# Altium project AMA4B_Core_board.PrjPcb (part 3 of 3)
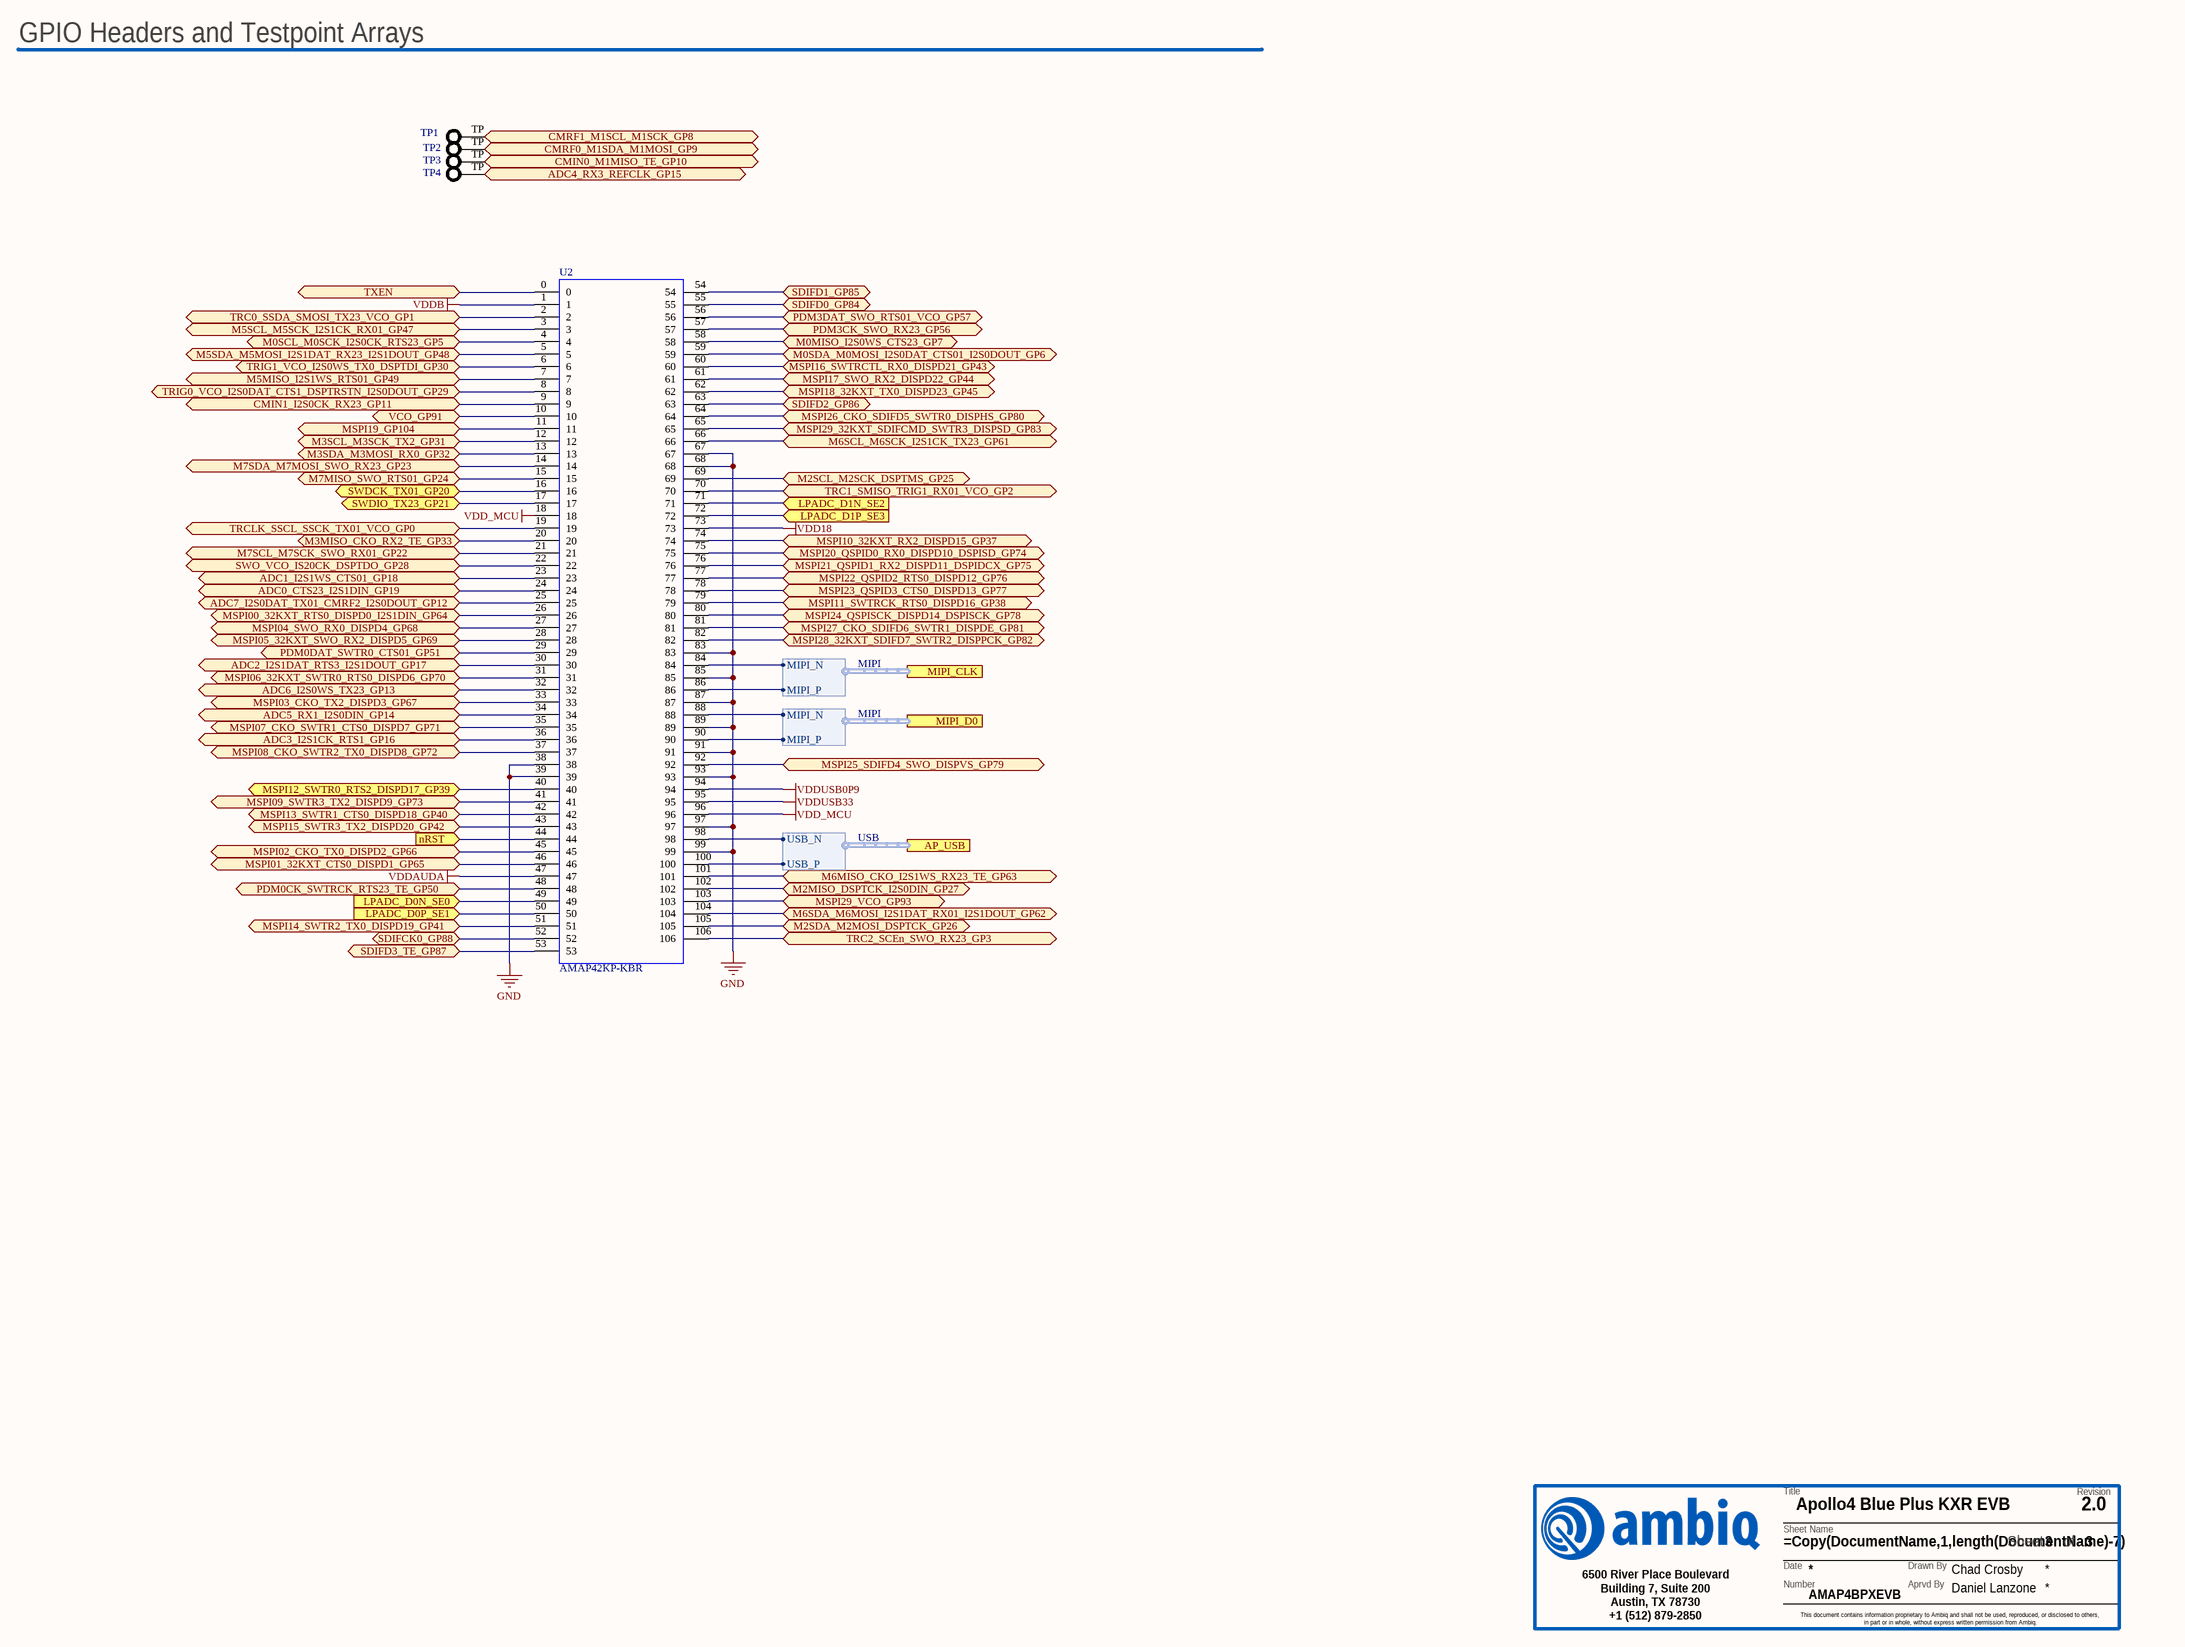
[diagram p5: P03_GPIO.SchDoc]

## Nets that join several sheets
GND: P02_ Apollo 4 Blue Plus (41 pins), P03_GPIO (12 pins)
VDD18: P02_ Apollo 4 Blue Plus (C17.1 U1.H10), P03_GPIO (U2.73)
VDD_MCU: P02_ Apollo 4 Blue Plus (12 pins), P03_GPIO (U2.18 U2.96)
VDDAUDA: P02_ Apollo 4 Blue Plus (C18.1 U1.B11), P03_GPIO (U2.47)
VDDB: P02_ Apollo 4 Blue Plus (C27.1 U1.G1), P03_GPIO (U2.1)
VDDUSB0P9: P02_ Apollo 4 Blue Plus (C21.1 U1.L7), P03_GPIO (U2.94)
VDDUSB33: P02_ Apollo 4 Blue Plus (C22.1 U1.K7), P03_GPIO (U2.95)
ADC0_CTS23_I2S1DIN_GP19: P02_ Apollo 4 Blue Plus (U1.C3), P03_GPIO (U2.24)
ADC1_I2S1WS_CTS01_GP18: P02_ Apollo 4 Blue Plus (U1.D3), P03_GPIO (U2.23)
ADC2_I2S1DAT_RTS3_I2S1DOUT_GP17: P02_ Apollo 4 Blue Plus (U1.D4), P03_GPIO (U2.30)
ADC3_I2S1CK_RTS1_GP16: P02_ Apollo 4 Blue Plus (U1.D7), P03_GPIO (U2.36)
ADC4_RX3_REFCLK_GP15: P02_ Apollo 4 Blue Plus (U1.E5), P03_GPIO (TP4.TP)
ADC5_RX1_I2S0DIN_GP14: P02_ Apollo 4 Blue Plus (U1.D6), P03_GPIO (U2.34)
ADC6_I2S0WS_TX23_GP13: P02_ Apollo 4 Blue Plus (U1.D5), P03_GPIO (U2.32)
ADC7_I2S0DAT_TX01_CMRF2_I2S0DOUT_GP12: P02_ Apollo 4 Blue Plus (U1.B4), P03_GPIO (U2.25)
AP4_USB_N: P02_ Apollo 4 Blue Plus (U1.M8), P03_GPIO (U2.98)
AP4_USB_P: P02_ Apollo 4 Blue Plus (U1.M7), P03_GPIO (U2.100)
CMIN0_M1MISO_TE_GP10: P02_ Apollo 4 Blue Plus (U1.E6), P03_GPIO (TP3.TP)
CMIN1_I2S0CK_RX23_GP11: P02_ Apollo 4 Blue Plus (U1.E4), P03_GPIO (U2.9)
CMRF0_M1SDA_M1MOSI_GP9: P02_ Apollo 4 Blue Plus (U1.E7), P03_GPIO (TP2.TP)
CMRF1_M1SCL_M1SCK_GP8: P02_ Apollo 4 Blue Plus (U1.E8), P03_GPIO (TP1.TP)
LPADC_D0N_SE0: P02_ Apollo 4 Blue Plus (U1.A10), P03_GPIO (U2.49)
LPADC_D0P_SE1: P02_ Apollo 4 Blue Plus (U1.A11), P03_GPIO (U2.50)
LPADC_D1N_SE2: P02_ Apollo 4 Blue Plus (U1.C11), P03_GPIO (U2.71)
LPADC_D1P_SE3: P02_ Apollo 4 Blue Plus (U1.D11), P03_GPIO (U2.72)
M0MISO_I2S0WS_CTS23_GP7: P02_ Apollo 4 Blue Plus (U1.J6), P03_GPIO (U2.58)
M0SCL_M0SCK_I2S0CK_RTS23_GP5: P02_ Apollo 4 Blue Plus (U1.H4), P03_GPIO (U2.4)
M0SDA_M0MOSI_I2S0DAT_CTS01_I2S0DOUT_GP6: P02_ Apollo 4 Blue Plus (U1.J5), P03_GPIO (U2.59)
M2MISO_DSPTCK_I2S0DIN_GP27: P02_ Apollo 4 Blue Plus (U1.M5), P03_GPIO (U2.102)
M2SCL_M2SCK_DSPTMS_GP25: P02_ Apollo 4 Blue Plus (U1.K5), P03_GPIO (U2.69)
M2SDA_M2MOSI_DSPTCK_GP26: P02_ Apollo 4 Blue Plus (U1.L5), P03_GPIO (U2.105)
M3MISO_CKO_RX2_TE_GP33: P02_ Apollo 4 Blue Plus (U1.G3), P03_GPIO (U2.20)
M3SCL_M3SCK_TX2_GP31: P02_ Apollo 4 Blue Plus (U1.H2), P03_GPIO (U2.12)
M3SDA_M3MOSI_RX0_GP32: P02_ Apollo 4 Blue Plus (U1.G2), P03_GPIO (U2.13)
M5MISO_I2S1WS_RTS01_GP49: P02_ Apollo 4 Blue Plus (U1.D1), P03_GPIO (U2.7)
M5SCL_M5SCK_I2S1CK_RX01_GP47: P02_ Apollo 4 Blue Plus (U1.F1), P03_GPIO (U2.3)
M5SDA_M5MOSI_I2S1DAT_RX23_I2S1DOUT_GP48: P02_ Apollo 4 Blue Plus (U1.E1), P03_GPIO (U2.5)
M6MISO_CKO_I2S1WS_RX23_TE_GP63: P02_ Apollo 4 Blue Plus (U1.M6), P03_GPIO (U2.101)
M6SCL_M6SCK_I2S1CK_TX23_GP61: P02_ Apollo 4 Blue Plus (U1.K6), P03_GPIO (U2.66)
M6SDA_M6MOSI_I2S1DAT_RX01_I2S1DOUT_GP62: P02_ Apollo 4 Blue Plus (U1.L6), P03_GPIO (U2.104)
M7MISO_SWO_RTS01_GP24: P02_ Apollo 4 Blue Plus (U1.E2), P03_GPIO (U2.15)
M7SCL_M7SCK_SWO_RX01_GP22: P02_ Apollo 4 Blue Plus (U1.F3), P03_GPIO (U2.21)
M7SDA_M7MOSI_SWO_RX23_GP23: P02_ Apollo 4 Blue Plus (U1.F2), P03_GPIO (U2.14)
MIPI_CLK.MIPI_N: P02_ Apollo 4 Blue Plus (U1.J12), P03_GPIO (U2.84)
MIPI_CLK.MIPI_P: P02_ Apollo 4 Blue Plus (U1.K12), P03_GPIO (U2.86)
MIPI_D0.MIPI_N: P02_ Apollo 4 Blue Plus (U1.L12), P03_GPIO (U2.88)
MIPI_D0.MIPI_P: P02_ Apollo 4 Blue Plus (U1.M12), P03_GPIO (U2.90)
MSPI00_32KXT_RTS0_DISPD0_I2S1DIN_GP64: P02_ Apollo 4 Blue Plus (U1.B6), P03_GPIO (U2.26)
MSPI01_32KXT_CTS0_DISPD1_GP65: P02_ Apollo 4 Blue Plus (U1.A7), P03_GPIO (U2.46)
MSPI02_CKO_TX0_DISPD2_GP66: P02_ Apollo 4 Blue Plus (U1.A8), P03_GPIO (U2.45)
MSPI03_CKO_TX2_DISPD3_GP67: P02_ Apollo 4 Blue Plus (U1.C6), P03_GPIO (U2.33)
MSPI04_SWO_RX0_DISPD4_GP68: P02_ Apollo 4 Blue Plus (U1.B7), P03_GPIO (U2.27)
MSPI05_32KXT_SWO_RX2_DISPD5_GP69: P02_ Apollo 4 Blue Plus (U1.B8), P03_GPIO (U2.28)
MSPI06_32KXT_SWTR0_RTS0_DISPD6_GP70: P02_ Apollo 4 Blue Plus (U1.C5), P03_GPIO (U2.31)
MSPI07_CKO_SWTR1_CTS0_DISPD7_GP71: P02_ Apollo 4 Blue Plus (U1.C7), P03_GPIO (U2.35)
MSPI08_CKO_SWTR2_TX0_DISPD8_GP72: P02_ Apollo 4 Blue Plus (U1.C8), P03_GPIO (U2.37)
MSPI09_SWTR3_TX2_DISPD9_GP73: P02_ Apollo 4 Blue Plus (U1.D8), P03_GPIO (U2.41)
MSPI10_32KXT_RX2_DISPD15_GP37: P02_ Apollo 4 Blue Plus (U1.F11), P03_GPIO (U2.74)
MSPI11_SWTRCK_RTS0_DISPD16_GP38: P02_ Apollo 4 Blue Plus (U1.F12), P03_GPIO (U2.79)
MSPI12_SWTR0_RTS2_DISPD17_GP39: P02_ Apollo 4 Blue Plus (U1.C9), P03_GPIO (U2.40)
MSPI13_SWTR1_CTS0_DISPD18_GP40: P02_ Apollo 4 Blue Plus (U1.C10), P03_GPIO (U2.42)
MSPI14_SWTR2_TX0_DISPD19_GP41: P02_ Apollo 4 Blue Plus (U1.E9), P03_GPIO (U2.51)
MSPI15_SWTR3_TX2_DISPD20_GP42: P02_ Apollo 4 Blue Plus (U1.D9), P03_GPIO (U2.43)
MSPI16_SWTRCTL_RX0_DISPD21_GP43: P02_ Apollo 4 Blue Plus (U1.D10), P03_GPIO (U2.60)
MSPI17_SWO_RX2_DISPD22_GP44: P02_ Apollo 4 Blue Plus (U1.E10), P03_GPIO (U2.61)
MSPI18_32KXT_TX0_DISPD23_GP45: P02_ Apollo 4 Blue Plus (U1.F10), P03_GPIO (U2.62)
MSPI19_GP104: P02_ Apollo 4 Blue Plus (U1.J2), P03_GPIO (U2.11)
MSPI20_QSPID0_RX0_DISPD10_DSPISD_GP74: P02_ Apollo 4 Blue Plus (U1.G11), P03_GPIO (U2.75)
MSPI21_QSPID1_RX2_DISPD11_DSPIDCX_GP75: P02_ Apollo 4 Blue Plus (U1.H11), P03_GPIO (U2.76)
MSPI22_QSPID2_RTS0_DISPD12_GP76: P02_ Apollo 4 Blue Plus (U1.J11), P03_GPIO (U2.77)
MSPI23_QSPID3_CTS0_DISPD13_GP77: P02_ Apollo 4 Blue Plus (U1.K11), P03_GPIO (U2.78)
MSPI24_QSPISCK_DISPD14_DSPISCK_GP78: P02_ Apollo 4 Blue Plus (U1.L11), P03_GPIO (U2.80)
MSPI25_SDIFD4_SWO_DISPVS_GP79: P02_ Apollo 4 Blue Plus (U1.M11), P03_GPIO (U2.92)
MSPI26_CKO_SDIFD5_SWTR0_DISPHS_GP80: P02_ Apollo 4 Blue Plus (U1.K10), P03_GPIO (U2.64)
MSPI27_CKO_SDIFD6_SWTR1_DISPDE_GP81: P02_ Apollo 4 Blue Plus (U1.L10), P03_GPIO (U2.81)
MSPI28_32KXT_SDIFD7_SWTR2_DISPPCK_GP82: P02_ Apollo 4 Blue Plus (U1.L9), P03_GPIO (U2.82)
MSPI29_32KXT_SDIFCMD_SWTR3_DISPSD_GP83: P02_ Apollo 4 Blue Plus (U1.K9), P03_GPIO (U2.65)
MSPI29_VCO_GP93: P02_ Apollo 4 Blue Plus (U1.M4), P03_GPIO (U2.103)
nRST: P02_ Apollo 4 Blue Plus (5 pins), P03_GPIO (U2.44)
PDM0CK_SWTRCK_RTS23_TE_GP50: P02_ Apollo 4 Blue Plus (U1.A9), P03_GPIO (U2.48)
PDM0DAT_SWTR0_CTS01_GP51: P02_ Apollo 4 Blue Plus (U1.B9), P03_GPIO (U2.29)
PDM3CK_SWO_RX23_GP56: P02_ Apollo 4 Blue Plus (U1.J7), P03_GPIO (U2.57)
PDM3DAT_SWO_RTS01_VCO_GP57: P02_ Apollo 4 Blue Plus (U1.J8), P03_GPIO (U2.56)
SDIFCK0_GP88: P02_ Apollo 4 Blue Plus (U1.F9), P03_GPIO (U2.52)
SDIFD0_GP84: P02_ Apollo 4 Blue Plus (U1.J9), P03_GPIO (U2.55)
SDIFD1_GP85: P02_ Apollo 4 Blue Plus (U1.H9), P03_GPIO (U2.54)
SDIFD2_GP86: P02_ Apollo 4 Blue Plus (U1.G10), P03_GPIO (U2.63)
SDIFD3_TE_GP87: P02_ Apollo 4 Blue Plus (U1.G9), P03_GPIO (U2.53)
SWDCK_TX01_GP20: P02_ Apollo 4 Blue Plus (U1.K3), P03_GPIO (U2.16)
SWDIO_TX23_GP21: P02_ Apollo 4 Blue Plus (U1.J3), P03_GPIO (U2.17)
SWO_VCO_IS20CK_DSPTDO_GP28: P02_ Apollo 4 Blue Plus (U1.E3), P03_GPIO (U2.22)
TRC0_SSDA_SMOSI_TX23_VCO_GP1: P02_ Apollo 4 Blue Plus (U1.J4), P03_GPIO (U2.2)
TRC1_SMISO_TRIG1_RX01_VCO_GP2: P02_ Apollo 4 Blue Plus (U1.K4), P03_GPIO (U2.70)
TRC2_SCEn_SWO_RX23_GP3: P02_ Apollo 4 Blue Plus (U1.L4), P03_GPIO (U2.106)
TRCLK_SSCL_SSCK_TX01_VCO_GP0: P02_ Apollo 4 Blue Plus (U1.H3), P03_GPIO (U2.19)
TRIG0_VCO_I2S0DAT_CTS1_DSPTRSTN_I2S0DOUT_GP29: P02_ Apollo 4 Blue Plus (U1.F4), P03_GPIO (U2.8)
TRIG1_VCO_I2S0WS_TX0_DSPTDI_GP30: P02_ Apollo 4 Blue Plus (U1.G4), P03_GPIO (U2.6)
TXEN: P02_ Apollo 4 Blue Plus (U1.K1), P03_GPIO (U2.0)
VCO_GP91: P02_ Apollo 4 Blue Plus (U1.K2), P03_GPIO (U2.10)

## Assembly variants
AMAP4BPXEVB: all parts fitted